# EAGLE design TSEM_R2 (EAGLE 9.1.0)
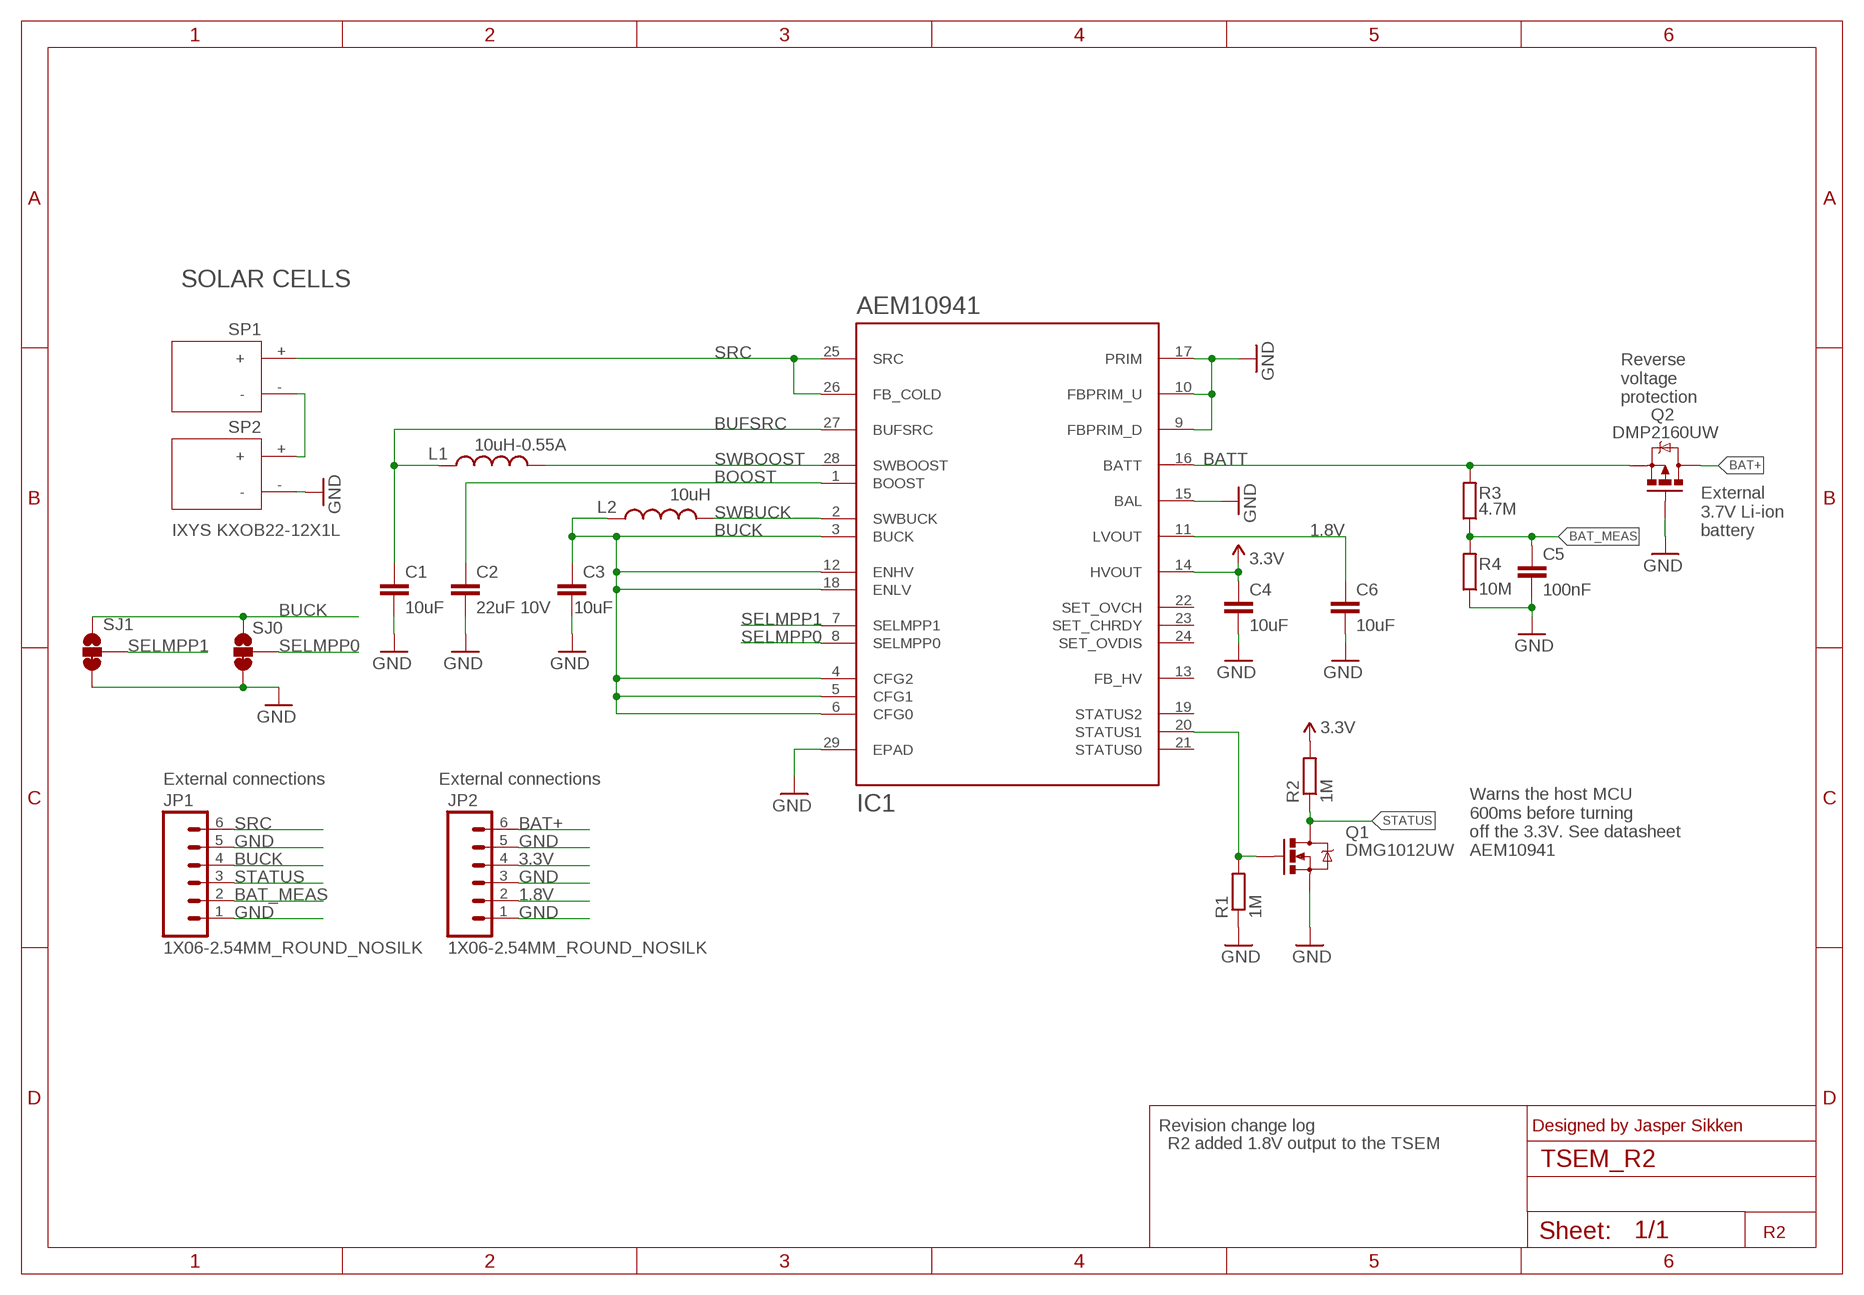
[diagram p0: schematic, sheet 1]

## Parts
C1  10uF  C0603_10UF  [C0603]
C2  22uF 10V  C0603_22UF  [C0603]
C3  10uF  C0603_10UF  [C0603]
C4  10uF  C0603_10UF  [C0603]
C5  100nF  C0402_100NF  [C0402]
C6  10uF  C0603_10UF  [C0603]
IC1  AEM10941  [QFN50P505X505X90-28]
JP1  1X06-2.54MM_ROUND_NOSILK  [1X06_2.54MM_ROUND_NOSILK]
JP2  1X06-2.54MM_ROUND_NOSILK  [1X06_2.54MM_ROUND_NOSILK]
L1  10uH-0.55A  L3.9X3.9_10UH_0.55A  [LPS4012]
L2  10uH  L0603_10UH  [L0603]
Q1  DMG1012UW  MOSFET-N-CHANNEL_DMG1012UW  [SOT323]
Q2  DMP2160UW  MOSFET-P-CHANNEL-DMP2160UW  [SOT323]
R1  1M  R0402_1M  [R0402]
R2  1M  R0402_1M  [R0402]
R3  4.7M  R0402_4.7M  [R0402]
R4  10M  R0402_10M  [R0402]
SJ0  SOLDERJUMPER_3WAY_12SHORT3WAY  [SJ_3S_NC_0402]
SJ1  SOLDERJUMPER_3WAY_12SHORT3WAY  [SJ_3S_NC_0402]
SP1  KXOB22-12X1  IXYS-KXOB22-12X1  [IXYS-KXOB22-12X1]
SP2  KXOB22-12X1  IXYS-KXOB22-12X1  [IXYS-KXOB22-12X1]

## Nets
1.8V: C6.1 IC1.11(LVOUT) JP2.2
3.3V: C4.1 IC1.14(HVOUT) JP2.4 R2.2
BAT+: JP2.6 Q2.3(D)
BAT_MEAS: C5.1 JP1.2 R3.1 R4.2
BATT: IC1.16(BATT) Q2.2(S) R3.2
BOOST: C2.1 IC1.1(BOOST)
BUCK: C3.1 IC1.3(BUCK) IC1.4(CFG2) IC1.5(CFG1) IC1.6(CFG0) IC1.12(ENHV) IC1.18(ENLV) JP1.4 L2.1 SJ0.3 SJ1.3
BUFSRC: C1.1 IC1.27(BUFSRC) L1.1
GND: C1.2 C2.2 C3.2 C4.2 C5.2 C6.2 IC1.9(FBPRIM_D) IC1.10(FBPRIM_U) IC1.15(BAL) IC1.17(PRIM) IC1.29(EPAD) JP1.1 JP1.5 JP2.1 JP2.3 JP2.5 Q1.2(S) Q2.1(G) R1.1 R4.1 SJ0.1 SJ1.1 SP2.-
N$2: SP1.- SP2.+
SELMPP0: IC1.8(SELMPP0) SJ0.2
SELMPP1: IC1.7(SELMPP1) SJ1.2
SRC: IC1.25(SRC) IC1.26(FB_COLD) JP1.6 SP1.+
STATUS: JP1.3 Q1.3(D) R2.1
STATUS1: IC1.20(STATUS1) Q1.1(G) R1.2
SWBOOST: IC1.28(SWBOOST) L1.2
SWBUCK: IC1.2(SWBUCK) L2.2
Unconnected: IC1.13(FB_HV) IC1.19(STATUS2) IC1.21(STATUS0) IC1.22(SET_OVCH) IC1.23(SET_CHRDY) IC1.24(SET_OVDIS)

## Notes on the sheet
- SOLAR CELLS
- Reverse 
  voltage 
  protection
- IXYS KXOB22-12X1L
- External 
  3.7V Li-ion
  battery
- External connections | External connections
- Warns the host MCU
  600ms before turning
  off the 3.3V. See datasheet
  AEM10941
- Revision change log | Designed by Jasper Sikken
- R2 added 1.8V output to the TSEM
- R2

## Library data of the parts
C1 C3 C4 C6 = sodaq:C: Non-polarized capacitor; FARNELL_OC: 2113070; MF: Taiyo Yuden; MPN: LMK107BBJ106MALT
C2 = sodaq:C: Non-polarized capacitor; FARNELL_OC: 2426957; MF: Murata; MPN: GRM188R61A226ME15D
C5 = sodaq:C: Non-polarized capacitor; ALT-PART: YES; FARNELL_OC: 1759388; MF: Multicomp; MPN: MC0402X104K160CT
IC1 = sodaq:AEM10941: Ambient Energy Manager from e-peas; MF: e-peas; MPN: AEM10941
JP1 JP2 = sodaq:1X06
L1 = sodaq:L: Inductor; FARNELL_OC: 2408076; MF: Coilcraft; MPN: LPS4012-103MRB
L2 = sodaq:L: Inductor; FARNELL_OC: 2215635; MF: TDK; MPN: MLZ1608M100WT
Q1 = sodaq:MOSFET-N-CHANNEL: Mosfet N channel; FARNELL_OC: 2061403; MF: Diodes; MPN: DMG1012UW-7
Q2 = sodaq:MOSFET-P-CHANNEL: MOSFET P Channel; FARNELL_OC: 1858672
R1 R2 = sodaq:R: Resistor; FARNELL_OC: 2502499; MF: Walsin; MPN: WR04X1004FTL
R3 = sodaq:R: Resistor; FARNELL_OC: 2447191; MF: Multicomp; MPN: MCWR04W4704FTL
R4 = sodaq:R: Resistor; FARNELL_OC: 2447097; MF: Multicomp; MPN: MCWR04X1005FTL
SJ0 SJ1 = sodaq:SOLDERJUMPER_3WAY_12SHORT
SP1 SP2 = sodaq:IXYS-KXOB22-12X1: Solar panel; DIGIKEY_OC: KXOB22-12X1F-ND; MF: IXYS; MPN: IXYS KXOB22-12X1L/F

## Board
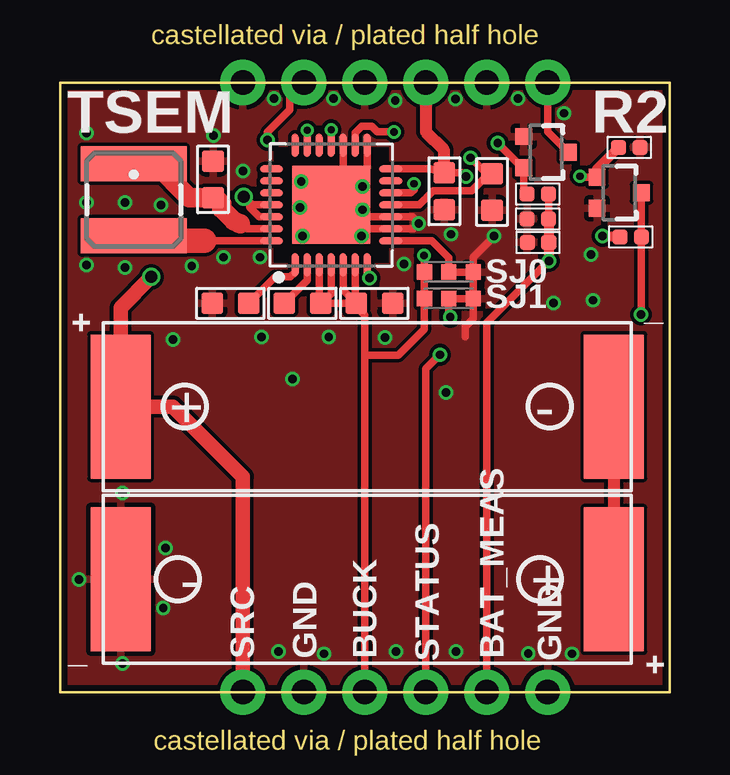
[diagram p1: board, top side]
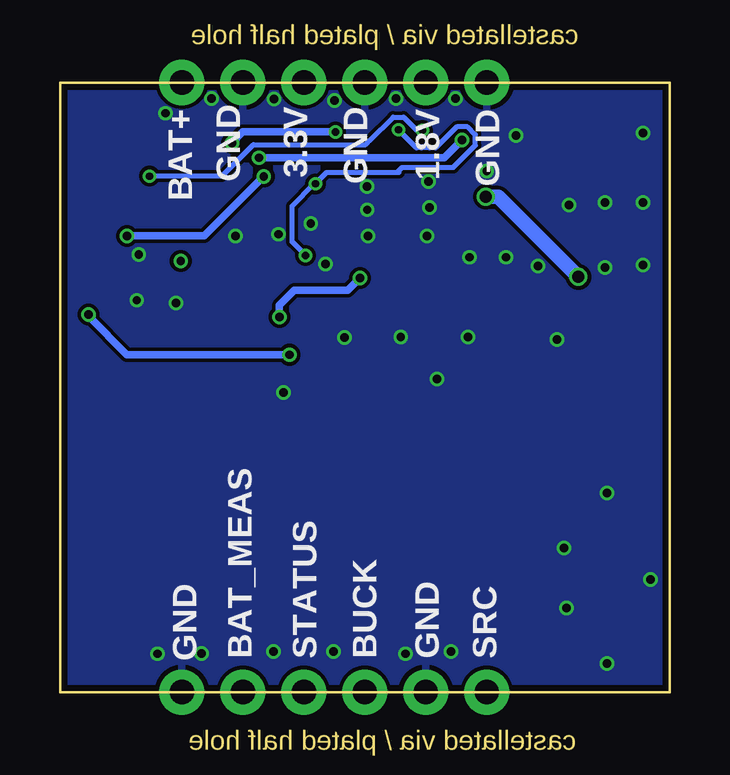
[diagram p2: board, bottom side, seen from below]

Size 25.4 x 25.4 mm. Coordinates in mm from the lower left corner, seen from the top.
Outline: 0,0 0,25.4 25.4,25.4 25.4,0 0,0
Copper layers (1*16): Top 0.018mm / dielectric 1.55mm / Bottom 0.018mm
Design rules "eC_2Layer_PClass6_BaseCopperO18_eCDefault (SODAQ EDIT)": minimum track width 0.15mm, minimum drill 0.3mm, track to track 0.15mm, track to pad 0.15mm, pad to pad 0.15mm, via to via 0.15mm, smd to smd 0mil, copper to edge 0.25mm, drill to drill 0.3mm, minimum pad ring 0.175mm, minimum via ring 0.125mm, stop-mask expansion 0mil, vias tented up to drill 0.45mm, thermal gap 0.2mm
tRestrict: area 13.9,19.1 to 14.6,20

### Footprints (pad centres in the part's own frame; a part is rotated, then mirrored left to right if it is on the bottom)
C0603 = smd 0.889 x 0.889: 1 -0.762,0; 2 0.762,0
C0402 = smd 0.635 x 0.635: 1 -0.445,0; 2 0.445,0
QFN50P505X505X90-28 = smd 0.977 x 0.292: 1 -2.486,1.5; 2 -2.486,1; 3 -2.486,0.5; 4 -2.486,0; 5 -2.486,-0.5; 6 -2.486,-1; 7 -2.486,-1.5; 15 2.486,-1.5; 16 2.486,-1; 17 2.486,-0.5; 18 2.486,0; 19 2.486,0.5; 20 2.486,1; 21 2.486,1.5 | smd 0.292 x 0.977: 8 -1.5,-2.486; 9 -1,-2.486; 10 -0.5,-2.486; 11 0,-2.486; 12 0.5,-2.486; 13 1,-2.486; 14 1.5,-2.486; 22 1.5,2.486; 23 1,2.486; 24 0.5,2.486; 25 0,2.486; 26 -0.5,2.486; 27 -1,2.486; 28 -1.5,2.486 | smd 3.25 x 3.25: 29 0,0
1X06_2.54MM_ROUND_NOSILK = drill 1.016 pad 1.88: 1 0,0; 2 2.54,0; 3 5.08,0; 4 7.62,0; 5 10.16,0; 6 12.7,0
LPS4012 = smd 1.45 x 4.4: 1 -1.5,0; 2 1.5,0
L0603 = smd 0.889 x 0.889: 1 -0.762,0; 2 0.762,0
SOT323 = smd 0.7 x 0.7: 1 -0.65,-0.925; 2 0.65,-0.925; 3 0,0.925
R0402 = smd 0.635 x 0.635: 1 -0.445,0; 2 0.445,0
SJ_3S_NC_0402 = smd 0.635 x 0.65: 1 -1.016,0; 2 0,0; 3 1.016,0
IXYS-KXOB22-12X1 = smd 2.5 x 6: + -10.279,0; - 10.279,0

### Placement (x,y rotation side)
C1  6.38,21.37 90 top
C2  7.1,16.2 180 top
C3  13.1,16.2 0 top
C4  16.02,20.87 270 top
C5  19.92,18.74 180 top
C6  18,20.84 270 top
IC1  11.3,20.3 90 top
JP1  20.32,0 180 top
JP2  7.62,25.4 0 top
L1  3.07,20.52 270 top
L2  10.1,16.2 180 top
Q1  23.3,20.81 270 top
Q2  20.25,22.5 270 top
R1  23.72,22.7 180 top
R2  23.78,18.97 180 top
R3  19.91,20.75 180 top
R4  19.91,19.72 0 top
SJ0  16.2,17.5 180 top
SJ1  16.2,16.4 180 top
SP1  12.8,11.9 0 top
SP2  12.8,4.7 180 top

### Tracks (layer width: path | path; a pad name or v marks a point on that pad's centre or on a via)
1.8V  (via drill 0.35)
  Top 0.305: IC1.11 14.97,20.3 15.18,20.51 15.27,20.6 15.27,20.61 15.55,20.89 17.16,20.89 17.87,21.6 C6.1 17.78,21.6 v17.11,22.27 | JP2.2 9.58,24.82 9.58,24.27 8.64,23.33 v8.64,23.01
  Bottom 0.305: v17.11,22.27 9.38,22.27 v8.64,23.01
3.3V  (via drill 0.35)
  Top 0.305: IC1.14 15.41,21.8 C4.1 16.77,21.63 v16.91,21.49
  Top 0.406: R2.2 22.65,18.97 v22.61,19.01
  Top 0.508: JP2.4 15.24,23.36 15.98,22.62 15.98,21.67 C4.1
  Bottom 0.305: v22.61,19.01 19.39,19.01 v16.91,21.49
BAT+
  Top 0.305: JP2.6 20.32,23.36 Q2.3
BAT_MEAS  (via drill 0.35)
  Top 0.305: R3.1 R4.2 | JP1.2 17.78,15.39 v20.36,17.98
  Top 0.406: R4.2 C5.1 v20.36,17.98 v20.37,17.97
BATT  (via drill 0.3, 0.35)
  Top 0.305: R3.2 19.32,20.89 Q2.2 19.27,21.85 v18.24,22.88 | 12.3,23.3 12.58,23.58 12.99,23.58 13.22,23.34 v13.92,23.34 | 12.3,23.3 12.3,22.85 | IC1.16 12.3,23.3
  Bottom 0.305: v13.92,23.34 17.78,23.34 v18.24,22.88
BOOST
  Top 0.305: IC1.1 9.8,17.5 9.6,17.3 8.96,17.3 C2.1
BUCK  (via drill 0.3)
  Top 0.305: IC1.3 10.8,16.26 L2.1 | L2.1 10.9,16.2 11.3,16.6 IC1.4 | IC1.5 11.8,16.74 C3.1 | IC1.6 12.3,16.24 C3.1 | L2.1 12.2,16.2 | 12.2,16.2 C3.1 | JP1.4 12.7,13.71 12.7,13.95 12.7,14.03 | 12.2,16.2 12.7,15.7 12.7,14.22 12.7,14.03 | v14.75,21.18 14.75,20.94 14.61,20.8 IC1.12 | 12.7,14.03 14.09,14.03 15.18,15.12 SJ1.3 SJ0.3 15.18,18.18 v15.17,18.2 | IC1.18 v11.3,23.44
  Bottom 0.2: 11.28,21.65 11.36,21.65 | 11.36,21.65 14.3,21.65 14.75,21.2 v14.75,21.18 14.8,21.18 15.73,20.25 15.73,18.76 v15.17,18.2 | 11.36,21.65 11.14,21.86 9.01,21.86 8.09,22.78 8.09,23.23 8.42,23.56 8.87,23.56 9.75,22.68 10,22.68 10.33,22.68 10.55,22.68 10.93,23.05 v11.3,23.43 v11.3,23.44
BUFSRC
  Top 0.305: IC1.27 7.8,19.3 7.5,19.52
  Top 0.813: L1.1 3.98,22.02 5.4,20.6 C1.1 6.5,20.6 6.74,20.36 6.74,20.14 7.25,19.64 7.46,19.54 7.5,19.52
GND  (via drill 0.35)
  Top 0.305: IC1.17 11.8,21.65 12.04,21.41 12.37,21.41 | IC1.15 12.8,21.84 12.37,21.41 | 12.27,19.8 IC1.10 14.68,19.8 v14.95,19.53 14.72,19.3 IC1.9 12.77,19.3 12.27,19.8 | 12.27,19.8 11.8,19.8 IC1.29 | v18.09,19 17.22,18.13 SJ0.1 SJ1.1 17.22,15.57 16.88,15.23 16.88,14.8 | IC1.29 11.84,20.3 | 11.84,20.3 v12.61,21.07 | IC1.29 11.84,20.3 | 11.84,20.3 v12.61,21.07 | IC1.29 11.84,20.3 | 11.84,20.3 v12.61,21.07 | IC1.29 12.37,21.37 12.37,21.41
  other vias: 9.69,13.05 11.2,14.8 8.92,24.73 22.12,18.23 22.2,16.33 16.09,12.48 8.4,14.8 4.7,14.7 2.7,17.7 1.1,17.8 4.2,20.3 1.1,23.3 6.4,23.2 10.1,19 16.5,1.7 21.34,1.6 11,1.6 14,1.7 2.6,1.2 21,24.12 14.33,17.84 20.56,16.22 10,20.2 12.6,20.1 4.4,6 2.6,8.3 0.8,4.7 1.1,20.4 2.7,20.4 9.1,1.7 4.3,3.5 13.54,14.78 19.51,1.61 16.29,19.08 19.08,24.73 13.97,24.65 11.4,24.74 16.48,24.72 7.62,21.71 5.49,17.76 8.34,18.12 6.82,18.12 10.05,21.27 12.56,19
  pour Top: 0,25.4 25.4,25.4 25.4,0 0,0
  pour Bottom: 0,25.4 0,0 25.4,0 25.4,25.4
N$2
  Top 0.508: SP1.- SP2.+
SELMPP0
  Top 0.305: IC1.8 15.49,18.8 16.2,18.09 SJ0.2
SELMPP1  (via drill 0.35)
  Top 0.305: IC1.7 12.8,17.34 v12.89,17.25 v12.9,17.25 | SJ1.2 16.2,15.69 v16.26,15.63
  Bottom 0.305: v12.9,17.25 13.41,16.74 15.64,16.74 16.26,16.12 v16.26,15.63
SRC  (via drill 0.5)
  Top 0.305: 8,20.3 v7.66,20.64 | IC1.25 8,20.3 | IC1.26 8.3,19.8 8.21,19.89 7.9,20.2 7.9,20.3 7.94,20.3 8,20.3
  Top 0.61: JP1.6 7.62,8.98 4.7,11.9 SP1.+ 2.52,16.02 v3.8,17.3
  Bottom 0.61: v3.8,17.3 4.45,17.95 7.13,20.64 v7.66,20.64
STATUS  (via drill 0.35)
  Top 0.305: Q1.3 R2.1 24.22,15.74 v24.21,15.73 | JP1.3 15.24,13.47 v15.83,14.06
  Bottom 0.305: v15.83,14.06 22.61,14.06 24.21,15.66 v24.21,15.73
STATUS1  (via drill 0.3)
  Top 0.305: IC1.20 v10.3,23.41 | Q1.1 21.71,21.46 v21.67,21.5
  Top 0.406: Q1.1 22.38,21.8 R1.2
  Bottom 0.2: v21.67,21.5 18.66,21.5 17.34,22.82 12.66,22.82 12.48,23 11.52,23.96 11.08,23.96 10.53,23.41 v10.3,23.41
SWBOOST
  Top 0.305: IC1.28 6,18.8
  Top 1.016: 6,18.8 3.29,18.8 L1.2
SWBUCK
  Top 0.305: IC1.2 10.3,17.16 L2.2

### Text on the board
Dimension: castellated via / plated half hole | castellated via / plated half hole
tPlace: TSEM | R2 | + | _ | _ | SRC | GND | BUCK | STATUS | BAT_MEAS | GND | +
bPlace: GND | 1.8V | GND | 3.3V | GND | BAT+ | SRC | GND | BUCK | STATUS | BAT_MEAS | GND